# Altium project Q24_ECU_V1.PrjPcb (part 1 of 3)
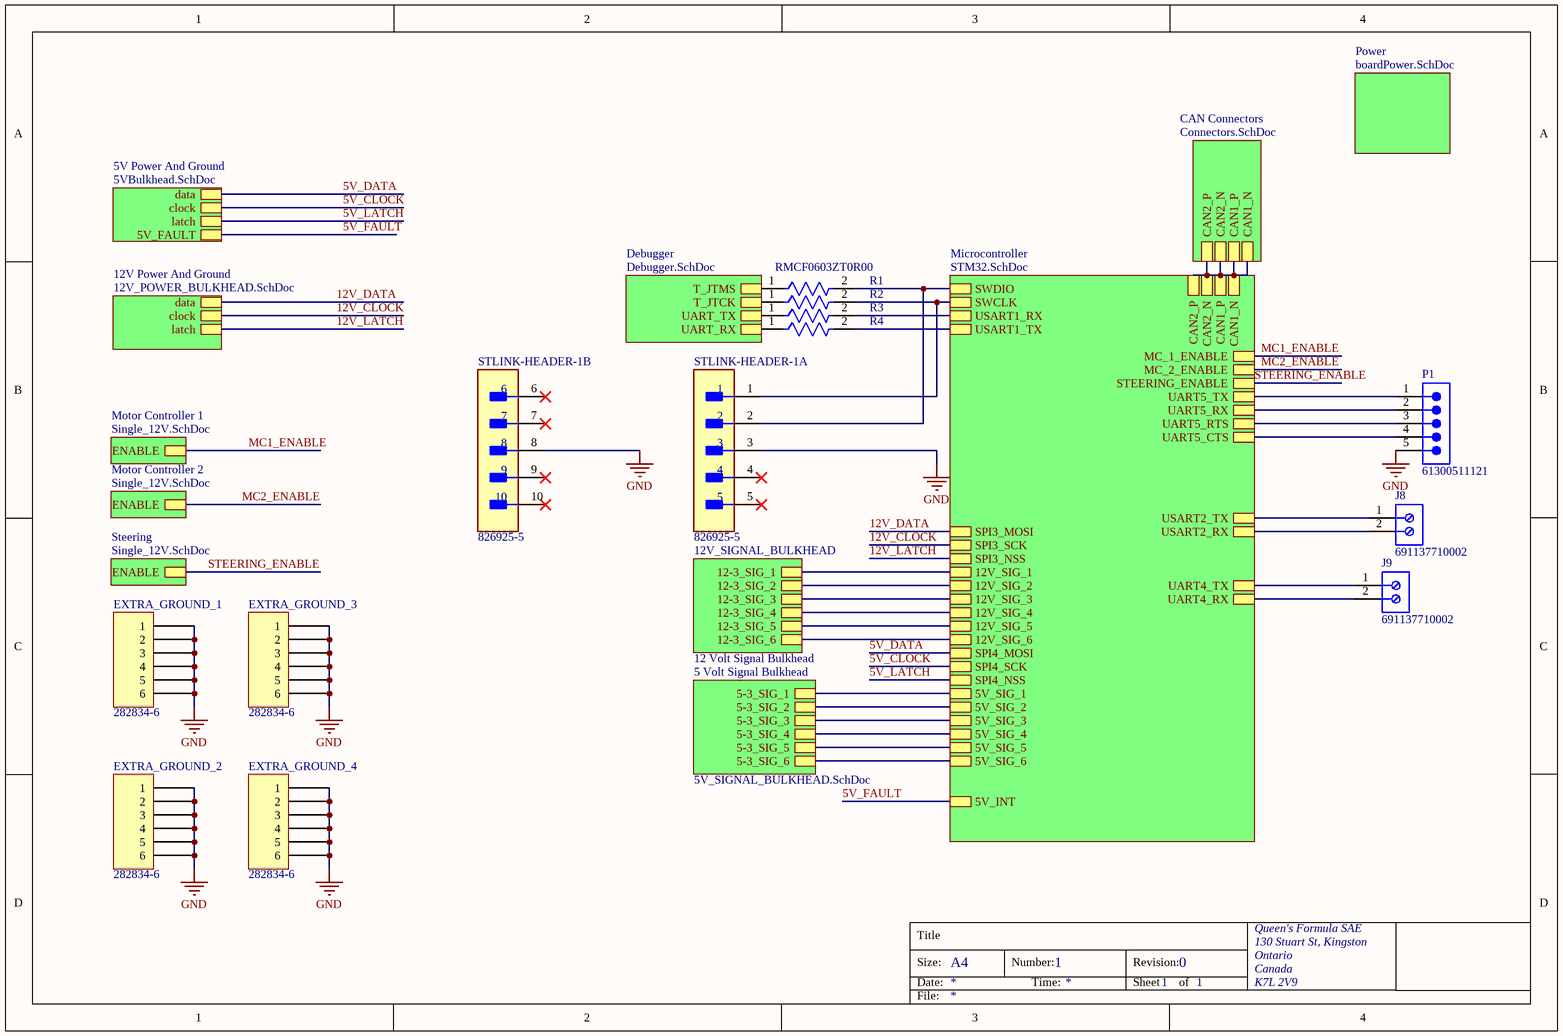
[diagram p0: TOP.SchDoc]
22 sheets, 325 parts. Net scope: hierarchical (ports join the sheet entries above them; power ports are global).
Board file: PCB.PcbDoc
Sheets:
  TOP.SchDoc
    Microcontroller = STM32.SchDoc
      CAN1 = CAN.SchDoc
      CAN2 = CAN.SchDoc
      Accelerometer And Gyro = IMU.SchDoc
    Debugger = Debugger.SchDoc
      MCU = DebuggerMCU.SchDoc
      POWER = Power.SchDoc
      CONNECTORS = DebuggerConnectors.SchDoc
    12V Power And Ground = 12V_POWER_BULKHEAD.SchDoc
      Shift Register = shiftRegister.SchDoc
      Designator = 12V_LS.SchDoc
      Designator = 12V_LS.SchDoc
      Designator = 12V_LS.SchDoc
      Designator = 12V_LS.SchDoc
      Designator = 12V_LS.SchDoc
      Designator = 12V_LS.SchDoc
    Power = boardPower.SchDoc
      Buck = Buck.SchDoc
      LDO = LDO.SchDoc
    CAN Connectors = Connectors.SchDoc
    12 Volt Signal Bulkhead = 12V_SIGNAL_BULKHEAD.SchDoc
       = 12_TO_3V3_VOLTAGE_DIVIDER.SchDoc
       = 12_TO_3V3_VOLTAGE_DIVIDER.SchDoc
       = 12_TO_3V3_VOLTAGE_DIVIDER.SchDoc
       = 12_TO_3V3_VOLTAGE_DIVIDER.SchDoc
       = 12_TO_3V3_VOLTAGE_DIVIDER.SchDoc
       = 12_TO_3V3_VOLTAGE_DIVIDER.SchDoc
    5V Power And Ground = 5VBulkhead.SchDoc
      Shift Register = shiftRegister.SchDoc
      5VLS1 = 5V_LS.SchDoc
      5VLS2 = 5V_LS.SchDoc
      5VLS3 = 5V_LS.SchDoc
      5VLS4 = 5V_LS.SchDoc
      5VLS5 = 5V_LS.SchDoc
      5VLS6 = 5V_LS.SchDoc
    5 Volt Signal Bulkhead = 5V_SIGNAL_BULKHEAD.SchDoc
      Designator = 5V_TO_3V_VD.SchDoc
      Designator = 5V_TO_3V_VD.SchDoc
      Designator = 5V_TO_3V_VD.SchDoc
      Designator = 5V_TO_3V_VD.SchDoc
      Designator = 5V_TO_3V_VD.SchDoc
      Designator = 5V_TO_3V_VD.SchDoc
    Motor Controller 1 = Single_12V.SchDoc
      Designator = 12V_LS.SchDoc
    Motor Controller 2 = Single_12V.SchDoc
      Designator = 12V_LS.SchDoc
    Steering = Single_12V.SchDoc
      Designator = 12V_LS.SchDoc

## Sheet TOP.SchDoc: =DocumentName
size A4; Organization: Queen's Formula SAE; Address1: 130 Stuart St, Kingston; Address2: Ontario; Address3: Canada; Address4: K7L 2V9; DocumentNumber: 1; Revision: 0; SheetNumber: 1; SheetTotal: 1

### Parts
EXTRA_GROUND_1  282834-6  [TE 282834-6]
EXTRA_GROUND_2  282834-6  [TE 282834-6]
EXTRA_GROUND_3  282834-6  [TE 282834-6]
EXTRA_GROUND_4  282834-6  [TE 282834-6]
J8  691137710002  [691137710002]
J9  691137710002  [691137710002]
P1  61300511121  [61300511121]
R1  RMCF0603ZT0R00  [FP-RMCF0603-MFG]
R2  RMCF0603ZT0R00  [FP-RMCF0603-MFG]  (value not drawn)
R3  RMCF0603ZT0R00  [FP-RMCF0603-MFG]  (value not drawn)
R4  RMCF0603ZT0R00  [FP-RMCF0603-MFG]  (value not drawn)
STLINK-HEADER-1  826925-5  [FP-826925-5-MFG]  (parts A,B of 2)

### Sub-sheets
5 Volt Signal Bulkhead = 5V_SIGNAL_BULKHEAD.SchDoc: 5-3_SIG_1, 5-3_SIG_2, 5-3_SIG_3, 5-3_SIG_4, 5-3_SIG_5, 5-3_SIG_6
5V Power And Ground = 5VBulkhead.SchDoc: data, clock, latch, 5V_FAULT
12 Volt Signal Bulkhead = 12V_SIGNAL_BULKHEAD: 12-3_SIG_1, 12-3_SIG_2, 12-3_SIG_3, 12-3_SIG_4, 12-3_SIG_5, 12-3_SIG_6
12V Power And Ground = 12V_POWER_BULKHEAD.SchDoc: data, clock, latch
CAN Connectors = Connectors.SchDoc: CAN1_N, CAN1_P, CAN2_N, CAN2_P
Debugger = Debugger.SchDoc: T_JTCK, T_JTMS, UART_TX, UART_RX
Microcontroller = STM32.SchDoc: SWDIO, SWCLK, USART1_RX, USART1_TX, SPI3_NSS, SPI3_MOSI, SPI3_SCK, CAN1_P, CAN1_N, CAN2_N, CAN2_P, 12V_SIG_1, MC_1_ENABLE, MC_2_ENABLE, STEERING_ENABLE, 12V_SIG_2, 12V_SIG_4, 12V_SIG_3, 12V_SIG_5, 12V_SIG_6, SPI4_NSS, SPI4_MOSI, SPI4_SCK, 5V_SIG_1, 5V_SIG_2, 5V_SIG_3, 5V_SIG_5, 5V_SIG_4, 5V_SIG_6, UART5_TX, UART5_RX, UART5_RTS, UART5_CTS, 5V_INT, USART2_TX, USART2_RX, UART4_TX, UART4_RX
Motor Controller 1 = Single_12V.SchDoc: ENABLE
Motor Controller 2 = Single_12V.SchDoc: ENABLE
Power = boardPower.SchDoc: no entries
Steering = Single_12V.SchDoc: ENABLE

### Nets
GND: EXTRA_GROUND_1.1 EXTRA_GROUND_1.2 EXTRA_GROUND_1.3 EXTRA_GROUND_1.4 EXTRA_GROUND_1.5 EXTRA_GROUND_1.6 EXTRA_GROUND_2.1 EXTRA_GROUND_2.2 EXTRA_GROUND_2.3 EXTRA_GROUND_2.4 EXTRA_GROUND_2.5 EXTRA_GROUND_2.6 EXTRA_GROUND_3.1 EXTRA_GROUND_3.2 EXTRA_GROUND_3.3 EXTRA_GROUND_3.4 EXTRA_GROUND_3.5 EXTRA_GROUND_3.6 EXTRA_GROUND_4.1 EXTRA_GROUND_4.2 EXTRA_GROUND_4.3 EXTRA_GROUND_4.4 EXTRA_GROUND_4.5 EXTRA_GROUND_4.6 P1.5 STLINK-HEADER-1.3 STLINK-HEADER-1.8
5-3_1: sheet Microcontroller/5V_SIG_1, sheet 5 Volt Signal Bulkhead/5-3_SIG_1
5-3_2: sheet Microcontroller/5V_SIG_2, sheet 5 Volt Signal Bulkhead/5-3_SIG_2
5-3_3: sheet Microcontroller/5V_SIG_3, sheet 5 Volt Signal Bulkhead/5-3_SIG_3
5-3_4: sheet Microcontroller/5V_SIG_4, sheet 5 Volt Signal Bulkhead/5-3_SIG_4
5-3_5: sheet Microcontroller/5V_SIG_5, sheet 5 Volt Signal Bulkhead/5-3_SIG_5
5-3_6: sheet Microcontroller/5V_SIG_6, sheet 5 Volt Signal Bulkhead/5-3_SIG_6
5V_CLOCK: sheet Microcontroller/SPI4_SCK, sheet 5V Power And Ground/clock
5V_DATA: sheet Microcontroller/SPI4_MOSI, sheet 5V Power And Ground/data
5V_FAULT: sheet Microcontroller/5V_INT, sheet 5V Power And Ground/5V_FAULT
5V_LATCH: sheet Microcontroller/SPI4_NSS, sheet 5V Power And Ground/latch
12-3_1: sheet Microcontroller/12V_SIG_1, sheet 12 Volt Signal Bulkhead/12-3_SIG_1
12-3_2: sheet Microcontroller/12V_SIG_2, sheet 12 Volt Signal Bulkhead/12-3_SIG_2
12-3_3: sheet Microcontroller/12V_SIG_3, sheet 12 Volt Signal Bulkhead/12-3_SIG_3
12-3_4: sheet Microcontroller/12V_SIG_4, sheet 12 Volt Signal Bulkhead/12-3_SIG_4
12-3_5: sheet Microcontroller/12V_SIG_5, sheet 12 Volt Signal Bulkhead/12-3_SIG_5
12-3_6: sheet Microcontroller/12V_SIG_6, sheet 12 Volt Signal Bulkhead/12-3_SIG_6
12V_CLOCK: sheet Microcontroller/SPI3_SCK, sheet 12V Power And Ground/clock
12V_DATA: sheet Microcontroller/SPI3_MOSI, sheet 12V Power And Ground/data
12V_LATCH: sheet Microcontroller/SPI3_NSS, sheet 12V Power And Ground/latch
CAN1_N: sheet Microcontroller/CAN1_P, sheet Microcontroller/CAN1_N, sheet Microcontroller/CAN2_N, sheet Microcontroller/CAN2_P, sheet CAN Connectors/CAN1_N, sheet CAN Connectors/CAN1_P, sheet CAN Connectors/CAN2_N, sheet CAN Connectors/CAN2_P
MC1_ENABLE: sheet Microcontroller/MC_1_ENABLE, sheet Motor Controller 1/ENABLE
MC2_ENABLE: sheet Microcontroller/MC_2_ENABLE, sheet Motor Controller 2/ENABLE
STEERING_ENABLE: sheet Microcontroller/STEERING_ENABLE, sheet Steering/ENABLE
T_JTCK: R2.1 ; sheet Debugger/T_JTCK
T_JTMS: R1.1 ; sheet Debugger/T_JTMS
UART_RX: R4.1 ; sheet Debugger/UART_RX
UART_TX: R3.1 ; sheet Debugger/UART_TX
NetJ8_1: J8.1 ; sheet Microcontroller/USART2_TX
NetJ8_2: J8.2 ; sheet Microcontroller/USART2_RX
NetJ9_1: J9.1 ; sheet Microcontroller/UART4_TX
NetJ9_2: J9.2 ; sheet Microcontroller/UART4_RX
NetP1_1: P1.1 ; sheet Microcontroller/UART5_TX
NetP1_2: P1.2 ; sheet Microcontroller/UART5_RX
NetP1_3: P1.3 ; sheet Microcontroller/UART5_RTS
NetP1_4: P1.4 ; sheet Microcontroller/UART5_CTS
NetR1_2: R1.2 STLINK-HEADER-1.2 ; sheet Microcontroller/SWDIO
NetR2_2: R2.2 STLINK-HEADER-1.1 ; sheet Microcontroller/SWCLK
NetR3_2: R3.2 ; sheet Microcontroller/USART1_RX
NetR4_2: R4.2 ; sheet Microcontroller/USART1_TX

Not connected (* = marked no-connect by the designer): STLINK-HEADER-1 4* 5* 6* 7* 9* 10*

### Notes on the sheet
- Title
- Size:
- Date:
- A4
- Number:
- Time:
- Revision:
- Sheet
- of
- File:

### Library data of the parts
EXTRA_GROUND_1-EXTRA_GROUND_4 = 282834-6: TERM BLK 6P SIDE ENT 2.54MM PCB; Manufacturer: TE Connectivity AMP Connectors; Current: 10A; Mating Orientation: Horizontal with Board; Number of Levels: 1; Pitch: 0.100" (2.54mm); Positions Per Level: 6; Voltage: 150V; Wire Gauge: 16-30 AWG; Wire Termination: Screw - Rising Cage Clamp; Part Number: 282834-6; Color: Green; ComponentLink1Description: Datasheet; ComponentLink1URL: https://www.te.com/commerce/DocumentDelivery/DDEController?Action=srchrtrv&DocNm=282834&DocType=Customer+Drawing&DocLang=English; ComponentLink2Description: DigiKey Link; ComponentLink2URL: http://digikey.com/product-detail/en/te-connectivity-amp-connectors/282834-6/A98337-ND/1153267; LastUpdated: 2020-01-15 4:16:31 AM; Lifecycle Status: Active; Minimum Order: 1; Mounting Type: Through Hole; Packaging: Bulk; Part Status: Active; Price: 4.72; Series: Buchanan; Supplier 1: DigiKey; Supplier Part Number 1: A98337-ND
J8 J9 = CMP-1502-03324-2: NexarPartId: 78871135; Voltage Rating: 300V; Number of Contacts: 2; Current Rating: 16A; Lead Pitch: 5mm; Height: 11.6mm; Packaging: Box; RoHS: Non-Compliant; Contact Material: Nickel, Tin; Max Operating Temperature: 120°C; Number of Pins: 2; Min Operating Temperature: -30°C; Number of Rows: 1
P1 = CMP-1502-01068-2: NexarPartId: 32855526; Operating Supply Voltage: 250V; Number of Contacts: 5; Connector Type: Male Pin; Current Rating: 3A; Contact Resistance: 20mΩ; Pitch: 2.54mm; Gender: Male; Termination: Solder; RoHS: Compliant; Lead Pitch: 2.54mm; Contact Mating Length: 5.9944mm; Number of Positions: 5; Lead Free: Lead Free; Contact Plating: Gold; Number of Pins: 5; Min Operating Temperature: -40°C; Voltage Rating: 250V; Color: Black; Mount: Through Hole; REACH SVHC: Unknown; Packaging: Bulk; Height: 8.89mm; Number of Rows: 1; Orientation: Vertical; Contact Material: Copper; Max Operating Temperature: 105°C
R1-R4 = CMP-26527-000011-1: RES 0 OHM JUMPER 1/10W 0603; Manufacturer: Stackpole; Power Rating: 0.1W; Voltage Rating: 75V; Resistance: 0mΩ; Automotive Grade: Grade 0; Value: 0mΩ; Series: RMCF; Manufacturer Part Number: RMCF0603ZT0R00; Device Class L1: Passive Components; Device Class L3: Chip SMD Resistors; Octopart: https://octopart.com/rmcf0603zt0r00-stackpole+electronics-19213618; Temperature: -55°C to +155°C; Lead Free: Yes; ComponentLink2URL: https://www.seielect.com/catalog/sei-rmcf_rmcp.pdf; Height: 0.55mm; Composition: Thick Film; Package: RMCF0603; Automotive: Yes; Temperature Range High: +155°C; Ipc Land Pattern Name: RESC15580X45; Digikey Description: RES 0 OHM JUMPER 1/10W 0603; RoHS: TRUE; ComponentLink2Description: Datasheet; Temperature Range Low: -55°C; Category: Res; Device Class L2: Resistors
STLINK-HEADER-1 = CMP-03369-000006-1: CONN HEADER VERT 10POS 2.54MM; Manufacturer: TE Connectivity; Conn Orientation: Vertical; Standoff Height: 0.3mm; Number Of Contacts: 10; Current Rating: 5A; Conn Gender: Male; Number Of Rows: 2; Category: Conn; Octopart: https://octopart.com/826925-5-te+connectivity-41836231; Lead Free: Yes; Height: 9.9mm; ComponentLink2Description: Datasheet; Temperature Range High: +105°C; Pitch: 2.54mm; Manufacturer Part Number: 826925-5; Automotive: No; Digikey Description: CONN HEADER VERT 10POS 2.54MM; ComponentLink2URL: https://www.te.com/commerce/DocumentDelivery/DDEController?Action=showdoc&DocId=Customer+Drawing%7F826629%7FAC%7Fpdf%7FEnglish%7FENG_CD_826629_AC.pdf%7F826925-5; Temperature: -65°C to +105°C; RoHS: TRUE; Package: 826925-5; Contact Material: Tin,Nickel; Mouser Description: Headers & Wire Housings 2X05 POS VERT TIN; Device Class L2: Headers and Wire Housings; Device Class L3: unset; Device Class L1: Connectors; Temperature Range Low: -65°C

## Sheet STM32.SchDoc
size A4
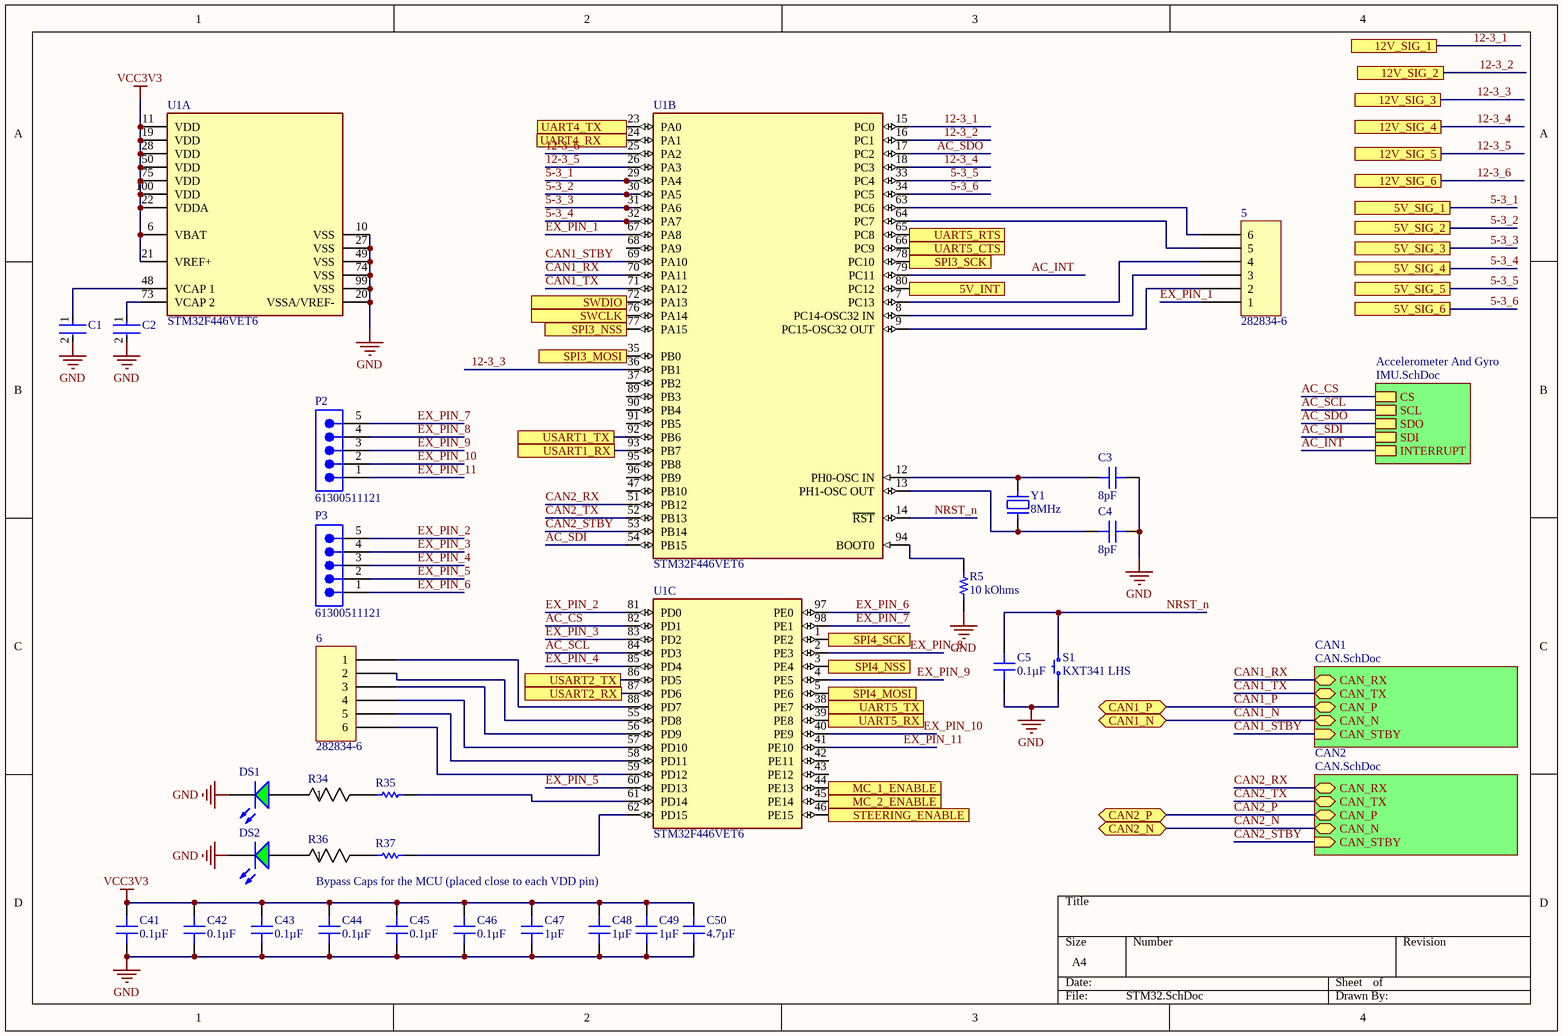
[diagram p1: STM32.SchDoc]

### Parts
5  282834-6  [TE 282834-6]
6  282834-6  [TE 282834-6]
C1  GRM188R71A225KE15D  [FP-GRM188-0_1-e0_2_0_5-MFG]  (value not drawn)
C2  GRM188R71A225KE15D  [FP-GRM188-0_1-e0_2_0_5-MFG]  (value not drawn)
C3  8pF  [CAP 0402_1005]
C4  8pF  [CAP 0402_1005]
C5  0.1µF  [CAP 0402_1005]
C41  0.1µF  [CAP 0402_1005]
C42  0.1µF  [CAP 0402_1005]
C43  0.1µF  [CAP 0402_1005]
C44  0.1µF  [CAP 0402_1005]
C45  0.1µF  [CAP 0402_1005]
C46  0.1µF  [CAP 0402_1005]
C47  1µF  [CAP 0402_1005]
C48  1µF  [CAP 0402_1005]
C49  1µF  [CAP 0402_1005]
C50  4.7µF  [CAP 0402_1005]
DS1  HLMP-4740  [AVAG-HLMP-4740]  (value not drawn)
DS2  HLMP-4740  [AVAG-HLMP-4740]  (value not drawn)
P2  61300511121  [61300511121]
P3  61300511121  [61300511121]
R5  10 kOhms  [RES 0402_1005]
R34  AC01000005000JA100  [RES_AC01_VIS]  (value not drawn)
R35  RC0805FR-071KL  [RESC2013X60X35ML10T20]  (value not drawn)
R36  AC01000005000JA100  [RES_AC01_VIS]  (value not drawn)
R37  RC0805FR-071KL  [RESC2013X60X35ML10T20]  (value not drawn)
S1  KXT341 LHS  [C&K KXT3]
U1  STM32F446VET6  [FP-LQFP100-1L-MFG]  (parts A,B,C of 3)
Y1  8MHz  [NDK NX3225GD]

### Sub-sheets
Accelerometer And Gyro = IMU.SchDoc: CS, SCL, SDO, SDI, INTERRUPT
CAN1 = CAN.SchDoc: CAN_RX (bidir), CAN_TX (bidir), CAN_STBY (in), CAN_P (bidir), CAN_N (bidir)
CAN2 = CAN.SchDoc: CAN_RX (bidir), CAN_TX (bidir), CAN_STBY (in), CAN_P (bidir), CAN_N (bidir)

### Ports
5V_INT, 5V_SIG_1, 5V_SIG_2, 5V_SIG_3, 5V_SIG_4, 5V_SIG_5, 5V_SIG_6, 12V_SIG_1, 12V_SIG_2, 12V_SIG_3, 12V_SIG_4, 12V_SIG_5, 12V_SIG_6, CAN1_N (bidir), CAN1_P (bidir), CAN2_N (bidir), CAN2_P (bidir), MC_1_ENABLE, MC_2_ENABLE, SPI3_MOSI, SPI3_NSS, SPI3_SCK, SPI4_MOSI, SPI4_NSS, SPI4_SCK, STEERING_ENABLE, SWCLK, SWDIO, UART4_RX, UART4_TX, UART5_CTS, UART5_RTS, UART5_RX, UART5_TX, USART1_RX, USART1_TX, USART2_RX, USART2_TX

### Nets
GND: C1.2 C2.2 C3.2 C4.2 C5.1 C41.1 C42.1 C43.1 C44.1 C45.1 C46.1 C47.1 C48.1 C49.1 C50.1 DS1.2(K) DS2.2(K) R5.1 S1.1 U1.10(VSS) U1.20(VSSA/VREF-) U1.27(VSS) U1.49(VSS) U1.74(VSS) U1.99(VSS)
VCC3V3: C41.2 C42.2 C43.2 C44.2 C45.2 C46.2 C47.2 C48.2 C49.2 C50.2 U1.6(VBAT) U1.11(VDD) U1.19(VDD) U1.21(VREF+) U1.22(VDDA) U1.28(VDD) U1.50(VDD) U1.75(VDD) U1.100(VDD)
5-3_1: U1.29(PA4) ; port 5V_SIG_1
5-3_2: U1.30(PA5) ; port 5V_SIG_2
5-3_3: U1.31(PA6) ; port 5V_SIG_3
5-3_4: U1.32(PA7) ; port 5V_SIG_4
5-3_5: U1.33(PC4) ; port 5V_SIG_5
5-3_6: U1.34(PC5) ; port 5V_SIG_6
5V_CLOCK: U1.1(PE2) ; port SPI4_SCK
5V_DATA: U1.5(PE6) ; port SPI4_MOSI
5V_FAULT: U1.80(PC12) ; port 5V_INT
5V_LATCH: U1.3(PE4) ; port SPI4_NSS
12-3_1: U1.15(PC0) ; port 12V_SIG_1
12-3_2: U1.16(PC1) ; port 12V_SIG_2
12-3_3: U1.36(PB1) ; port 12V_SIG_3
12-3_4: U1.18(PC3) ; port 12V_SIG_4
12-3_5: U1.26(PA3) ; port 12V_SIG_5
12-3_6: U1.25(PA2) ; port 12V_SIG_6
12V_CLOCK: U1.78(PC10) ; port SPI3_SCK
12V_DATA: U1.35(PB0) ; port SPI3_MOSI
12V_LATCH: U1.77(PA15) ; port SPI3_NSS
AC_CS: U1.82(PD1) ; sheet Accelerometer And Gyro/CS
AC_INT: U1.79(PC11) ; sheet Accelerometer And Gyro/INTERRUPT
AC_SCL: U1.84(PD3) ; sheet Accelerometer And Gyro/SCL
AC_SDI: U1.54(PB15) ; sheet Accelerometer And Gyro/SDI
AC_SDO: U1.17(PC2) ; sheet Accelerometer And Gyro/SDO
CAN1_N: port CAN1_P, port CAN1_N, port CAN2_P, port CAN2_N, sheet CAN1/CAN_P, sheet CAN1/CAN_N, sheet CAN2/CAN_P, sheet CAN2/CAN_N  [also labelled CAN1_P, CAN2_N, CAN2_P]
CAN1_RX: U1.70(PA11) ; sheet CAN1/CAN_RX
CAN1_STBY: U1.69(PA10) ; sheet CAN1/CAN_STBY
CAN1_TX: U1.71(PA12) ; sheet CAN1/CAN_TX
CAN2_RX: U1.51(PB12) ; sheet CAN2/CAN_RX
CAN2_STBY: U1.53(PB14) ; sheet CAN2/CAN_STBY
CAN2_TX: U1.52(PB13) ; sheet CAN2/CAN_TX
EX_PIN_1: 5.1 U1.67(PA8)
EX_PIN_2: P3.5 U1.81(PD0)
EX_PIN_3: P3.4 U1.83(PD2)
EX_PIN_4: P3.3 U1.85(PD4)
EX_PIN_5: P3.2 U1.60(PD13)
EX_PIN_6: P3.1 U1.97(PE0)
EX_PIN_7: P2.5 U1.98(PE1)
EX_PIN_8: P2.4 U1.2(PE3)
EX_PIN_9: P2.3 U1.4(PE5)
EX_PIN_10: P2.2 U1.40(PE9)
EX_PIN_11: P2.1 U1.41(PE10)
MC1_ENABLE: U1.44(PE13) ; port MC_1_ENABLE
MC2_ENABLE: U1.45(PE14) ; port MC_2_ENABLE
NRST_n: C5.2 S1.2 U1.14(~{RST})
STEERING_ENABLE: U1.46(PE15) ; port STEERING_ENABLE
Net5_2: 5.2 U1.9(PC15-OSC32_OUT)
Net5_3: 5.3 U1.8(PC14-OSC32_IN)
Net5_4: 5.4 U1.7(PC13)
Net5_5: 5.5 U1.64(PC7)
Net5_6: 5.6 U1.63(PC6)
Net6_1: 6.1 U1.88(PD7)
Net6_2: 6.2 U1.55(PD8)
Net6_3: 6.3 U1.56(PD9)
Net6_4: 6.4 U1.57(PD10)
Net6_5: 6.5 U1.58(PD11)
Net6_6: 6.6 U1.59(PD12)
NetC1_1: C1.1 U1.48(VCAP_1)
NetC2_1: C2.1 U1.73(VCAP_2)
NetC3_1: C3.1 U1.12(PH0-OSC_IN) Y1.2
NetC4_1: C4.1 U1.13(PH1-OSC_OUT) Y1.1
NetDS1_1: DS1.1(A) R34.1
NetDS2_1: DS2.1(A) R36.1
NetJ8_1: U1.86(PD5) ; port USART2_TX
NetJ8_2: U1.87(PD6) ; port USART2_RX
NetJ9_1: U1.23(PA0) ; port UART4_TX
NetJ9_2: U1.24(PA1) ; port UART4_RX
NetP1_1: U1.38(PE7) ; port UART5_TX
NetP1_2: U1.39(PE8) ; port UART5_RX
NetP1_3: U1.65(PC8) ; port UART5_RTS
NetP1_4: U1.66(PC9) ; port UART5_CTS
NetR1_2: U1.72(PA13) ; port SWDIO
NetR2_2: U1.76(PA14) ; port SWCLK
NetR3_2: U1.93(PB7) ; port USART1_RX
NetR4_2: U1.92(PB6) ; port USART1_TX
NetR5_2: R5.2 U1.94(BOOT0)
NetR34_2: R34.2 R35.1
NetR35_2: R35.2 U1.61(PD14)
NetR36_2: R36.2 R37.1
NetR37_2: R37.2 U1.62(PD15)

Not connected (* = marked no-connect by the designer): U1 37(PB2) 42(PE11) 43(PE12) 47(PB10) 68(PA9) 89(PB3) 90(PB4) 91(PB5) 95(PB8) 96(PB9)

### Notes on the sheet
- Bypass Caps for the MCU (placed close to each VDD pin)

### Library data of the parts
5 6 = 282834-6: as EXTRA_GROUND_1 on sheet TOP; Part Number: 282834-6; Color: Green; ComponentLink1Description: Datasheet; ComponentLink1URL: https://www.te.com/commerce/DocumentDelivery/DDEController?Action=srchrtrv&DocNm=282834&DocType=Customer+Drawing&DocLang=English; ComponentLink2Description: DigiKey Link; ComponentLink2URL: http://digikey.com/product-detail/en/te-connectivity-amp-connectors/282834-6/A98337-ND/1153267; LastUpdated: 2020-01-15 4:16:31 AM; Lifecycle Status: Active; Minimum Order: 1; Mounting Type: Through Hole; Packaging: Bulk; Part Status: Active; Price: 4.72; Series: Buchanan; Supplier 1: DigiKey; Supplier Part Number 1: A98337-ND
C1 C2 = CMP-2006-02836-2: Chip Multilayer Ceramic Capacitors for General Purpose, 0603, 2.2uF, X7R, 15%, 10%, 10V; Case Code (Metric): 1608; Height: 0.8mm; Packaging: Cut Tape; Voltage: 10V; Lead Free: Lead Free; Min Operating Temperature: -55°C; Voltage Rating (DC): 10V; Max Operating Temperature: 125°C; Voltage Rating: 10V; Dielectric: X7R; Depth: 0.8mm; Case Code (Imperial): 0603; Termination: SMD/SMT; Case/Package: 0603; Number of Pins: 2; REACH SVHC: No SVHC; Mount: Surface Mount; Width: 0.031inch; Material: Ceramic; Capacitance: 2.2uF; Package Quantity: 1; Weight: 7.1E-05oz; Length: 1.6mm; Thickness: 0.035inch; Tolerance: 10%
C3 C4 = C1005NP01H080D050BA: CAP CER 8PF 50V NP0 0402; Manufacturer: TDK Corporation; Temperature Coefficient: C0G, NP0; Tolerance: ±0.5pF; Part Number: C1005NP01H080D050BA; Value: 8pF; Applications: General Purpose; Capacitance: 8pF; ComponentLink1Description: Datasheet; ComponentLink1URL: https://product.tdk.com/info/en/catalog/datasheets/mlcc_commercial_hightemp_en.pdf?ref_disty=digikey; ComponentLink2Description: DigiKey Link; ComponentLink2URL: http://digikey.com/product-detail/en/tdk-corporation/C1005NP01H080D050BA/445-13781-1-ND/3955447; Device Package: 0402 (1005 Metric); Features: High Temperature; LastUpdated: 2020-09-02 1:02:24 AM; Lifecycle Status: Active; Minimum Order: 1; Mounting Type: Surface Mount, MLCC; Operating Temperature: -55°C ~ 150°C; Package / Case: 0402 (1005 Metric); Packaging: TapeAndReel; PartId: 2033; Part Status: Active; Price: 0.01; Series: C; Size / Dimension: 0.039" L x 0.020" W (1.00mm x 0.50mm); Supplier 1: DigiKey; Supplier Part Number 1: 445-13781-1-ND; Thickness (Max): 0.022" (0.55mm); Voltage - Rated: 50V
C5 C41-C46 = C0402C104K4RECAUTO: CAP CER 0402 0.1UF 16V X7R 10%; Manufacturer: KEMET; Part Number: C0402C104K4RECAUTO; Value: 0.1µF; Applications: Automotive, ESD Protection; Capacitance: 0.1µF; ComponentLink1Description: Datasheet; ComponentLink1URL: https://api.kemet.com/component-edge/download/datasheet/C0402C104K4RECAUTO.pdf; ComponentLink2Description: DigiKey Link; ComponentLink2URL: http://digikey.com/product-detail/en/kemet/C0402C104K4RECAUTO/399-17167-1-ND/8563708; Device Package: 0402 (1005 Metric); LastUpdated: 2020-09-02 1:02:25 AM; Lifecycle Status: Active; Minimum Order: 1; Mounting Type: Surface Mount, MLCC; Operating Temperature: -55°C ~ 125°C; Package / Case: 0402 (1005 Metric); Packaging: TapeAndReel; PartId: 1731; Part Status: Active; Price: 0.02; Series: ESD SMD Auto X7R; Size / Dimension: 0.039" L x 0.020" W (1.00mm x 0.50mm); Supplier 1: DigiKey; Supplier Part Number 1: 399-17167-1-ND; Temperature Coefficient: X7R; Thickness (Max): 0.022" (0.55mm); Tolerance: ±10%; Voltage - Rated: 16V; Ratings: AEC-Q200
C47-C49 = CGB2A1X5R1A105K033BC: CAP CER 1UF 10V X5R 0402; Manufacturer: TDK Corporation; Tolerance: ±10%; Part Number: CGB2A1X5R1A105K033BC; Value: 1µF; Applications: General Purpose; Capacitance: 1µF; ComponentLink1Description: Datasheet; ComponentLink1URL: https://product.tdk.com/info/en/catalog/datasheets/mlcc_commercial_lowprofile_en.pdf?ref_disty=digikey; ComponentLink2Description: DigiKey Link; ComponentLink2URL: http://digikey.com/product-detail/en/tdk-corporation/CGB2A1X5R1A105K033BC/445-13179-1-ND/3954845; Device Package: 0402 (1005 Metric); LastUpdated: 2020-09-02 1:02:25 AM; Lifecycle Status: Active; Minimum Order: 1; Mounting Type: Surface Mount, MLCC; Operating Temperature: -55°C ~ 85°C; Package / Case: 0402 (1005 Metric); Packaging: TapeAndReel; PartId: 1796; Part Status: Active; Price: 0.02; Series: CGB; Size / Dimension: 0.039" L x 0.020" W (1.00mm x 0.50mm); Supplier 1: DigiKey; Supplier Part Number 1: 445-13179-1-ND; Temperature Coefficient: X5R; Thickness (Max): 0.013" (0.33mm); Voltage - Rated: 10V; Features: Low Profile
C50 = C1005X5R1A475K050BC: CAP CER 4.7UF 10V X5R 0402; Manufacturer: TDK Corporation; Tolerance: ±10%; Part Number: C1005X5R1A475K050BC; Value: 4.7µF; Applications: General Purpose; Capacitance: 4.7µF; ComponentLink1Description: Datasheet; ComponentLink1URL: https://product.tdk.com/info/en/catalog/datasheets/mlcc_commercial_general_en.pdf?ref_disty=digikey; ComponentLink2Description: DigiKey Link; ComponentLink2URL: http://digikey.com/product-detail/en/tdk-corporation/C1005X5R1A475K050BC/445-13820-1-ND/3955486; Device Package: 0402 (1005 Metric); LastUpdated: 2020-09-02 1:02:25 AM; Lifecycle Status: Active; Minimum Order: 1; Mounting Type: Surface Mount, MLCC; Operating Temperature: -55°C ~ 85°C; Package / Case: 0402 (1005 Metric); Packaging: TapeAndReel; PartId: 1759; Part Status: Active; Price: 0.10; Series: C; Size / Dimension: 0.039" L x 0.020" W (1.00mm x 0.50mm); Supplier 1: DigiKey; Supplier Part Number 1: 445-13820-1-ND; Temperature Coefficient: X5R; Thickness (Max): 0.022" (0.55mm); Voltage - Rated: 10V; Features: Low ESL
DS1 DS2 = CMP-2000-06413-1: T-1 3/4 (5 mm) Low Current LED Lamp, Green, 1.9 V, -20 to 100 degC, 2-Pin THD, RoHS, Bulk; Manufacturer: AvagoTechnologies; Type: Uni-Color; Peak Wavelength: 565nm; Rad Hard: No; Viewing Angle: 50°; Dominant Wavelength/Color Temperature: 569nm; Number of LEDs: 1; Lens Appearance: ColoredDiffused; Lens Shape Type: Circular; Mounting Orientation: TopMount; Intensity: 2.3mcd; Datasheet Version: 07/2014; Category: LEDs; Datasheet URL: http://docs.avagotech.com/docs/AV02-1557EN; Packaging: Bulk; Pin Count: 2; Mounting Technology: ThroughHole; Package Reference: HLMP-4740; Mounting: ThroughHole; Manufacturer URL: http://www.avagotech.com/; Color: Green; Package: 2T-13/4; Package Description: 2-Pin Through Hole Device, Dia 5.845 mm, Pitch 2.54 mm
P2 P3 = CMP-1502-01068-2: as P1 on sheet TOP; Termination: Solder; RoHS: Compliant; Lead Pitch: 2.54mm; Contact Mating Length: 5.9944mm; Number of Positions: 5; Lead Free: Lead Free; Contact Plating: Gold; Number of Pins: 5; Min Operating Temperature: -40°C; Voltage Rating: 250V; Color: Black; Mount: Through Hole; REACH SVHC: Unknown; Packaging: Bulk; Height: 8.89mm; Number of Rows: 1; Orientation: Vertical; Contact Material: Copper; Max Operating Temperature: 105°C
R5 = CRCW040210K0DHEDP: RES SMD 10K OHM 0.5% 1/16W 0402; Manufacturer: Vishay Dale; Power (Watts): 0.063W, 1/16W; Temperature Coefficient: ±50ppm/°C; Part Number: CRCW040210K0DHEDP; Value: 10 kOhms; ComponentLink1Description: Datasheet; ComponentLink1URL: http://www.vishay.com/docs/20036/dcrcwpe3.pdf; ComponentLink2Description: DigiKey Link; ComponentLink2URL: http://digikey.com/product-detail/en/vishay-dale/CRCW040210K0DHEDP/541-10KAVCT-ND/3593906; Composition: Thick Film; Device Package: 0402 (1005 Metric); Height - Seated (Max): 0.016" (0.40mm); LastUpdated: 2020-09-02 1:08:05 AM; Lifecycle Status: Active; Minimum Order: 1; Number of Terminations: 2; Operating Temperature: -55°C ~ 155°C; Package / Case: 0402 (1005 Metric); Packaging: TapeAndReel; PartId: 5057; Part Status: Active; Price: 0.03; Resistance: 10 kOhms; Series: CRCW-P; Size / Dimension: 0.039" L x 0.020" W (1.00mm x 0.50mm); Supplier 1: DigiKey; Supplier Part Number 1: 541-10KAVCT-ND; Supplier Device Package: 0402; Tolerance: ±0.5%; Features: Automotive AEC-Q200; Ratings: AEC-Q200
R34 R36 = CMP-00030-39746512-1: AC01000005000JA100 Res Wirewound 500 Ohm 5% 1W 100ppm/°C to 180ppm/°C Conformal AXL Thru-Hole Ammo Pack; Voltage Rating (DC): 22V; Lead Diameter: 800µm; Resistance: 500Ω; Weight: 519.986953mg; Number of Pins: 2; Min Operating Temperature: -40°C; Case/Package: Axial; Schedule B: 8533210080, 8533210080; Features: Flame Retardant Coating; Power Rating: 1W; Max Power Dissipation: 1W; Packaging: Tape & Box (TB); RoHS: Compliant; REACH SVHC: Unknown; NexarPartId: 39746512; Temperature Coefficient: 180ppm/°C; Diameter: 4.3mm; Contact Plating: Tin; Radiation Hardening: No; Max Operating Temperature: 275°C; Length: 11mm; Tolerance: 5%; Composition: Wirewound; Number of Terminations: 2; Termination: Axial; Voltage Rating: 22V
R35 R37 = CMP-2100-03671-1: Chip Resistor, 1 KOhm, +/- 1%, 125 mW, -55 to 155 degC, 0805 (2012 Metric), RoHS, Tape and Reel; Manufacturer: Yageo; Temperature Coefficient: 100ppm/degreesC; Voltage Rating (DC): 150V; Max Power Dissipation: 125mW; Resistance: 1KOhm; Number of Pins: 2; Number of Terminations: 2; Datasheet URL: http://www.yageo.com/NewPortal/yageodocoutput?fileName=/pdf/R-Chip/PYu-RC_Group_51_RoHS_L_5.pdf; Length: 0.079inch; Package Description: 2-Pin Surface Mounted Device, Body 2 x 1.25 mm; Depth: 1.25mm; Height: 0.024inch; Military Standard: Not; Case/Package: 0805; Package Reference: 0805; RoHSCompliant: true; Lead Free: LeadFree; Packaging: TapeandReel; Package Quantity: 1; Datasheet Version: Rev. 5, 10/2016; Tolerance: 1%; Min Operating Temperature: -55degC; Voltage Rating: 150V; Composition: ThickFilm; Case Code (Imperial): 0805; Power Rating: 125mW; Width: 0.049inch; Case Code (Metric): 2012; Manufacturer URL: http://www.yageo.com/; Max Operating Temperature: 155degC; REACH SVHC: Unknown; Termination: SMD/SMT
S1 = KXT341 LHS: SWITCH TACTILE SPST-NO 0.02A 15V; Manufacturer: C&K; Actuator Height off PCB, Vertical: 0.60mm; Actuator Orientation: Top Actuated; Actuator Type: Standard; Contact Rating @ Voltage: 0.02A @ 15VDC; Illumination: Non-Illuminated; Operating Force: 330gf; Outline: 3.00mm x 2.00mm; Switch Function: Off-Mom; Part Number: KXT341 LHS; Circuit: SPST-NO; ComponentLink1Description: Datasheet; ComponentLink1URL: https://dznh3ojzb2azq.cloudfront.net/products/Tactile/KXT3/documents/datasheet.pdf; ComponentLink2Description: DigiKey Link; ComponentLink2URL: http://digikey.com/product-detail/en/c-k/KXT341-LHS/CKN10781CT-ND/6607324; LastUpdated: 2020-09-02 1:27:07 AM; Lifecycle Status: Active; Minimum Order: 1; Mounting Type: Surface Mount; Operating Temperature: -40°C ~ 85°C; Packaging: TapeAndReel; Part Status: Active; Price: 0.14; Series: KXT3; Supplier 1: DigiKey; Supplier Part Number 1: CKN10781CT-ND; Termination Style: SMD (SMT) Tab
U1 = CMP-12105-000075-1: IC MCU 32BIT 512KB FLASH 100LQFP; Manufacturer: STMicroelectronics; Ram Size: 128KBytes; Data Bus Width: 32bits; Max Junction Temp: +125°C; Number Of Adc Channels: 16; Max Supply Voltage: 3.6V; Nominal Supply Current: 1.4-86mA; Number Of Uart Channels: 6; Core Architecture: ARM Cortex-M4; Standoff Height: 0.05mm; Number Of A/D Converters: 3; Frequency: 180MHz; Number Of Cores: 1; Min Supply Voltage: 1.65V; Number Of Timers/Counters: 14; Number Of Usb Channels: 2; Number Of Spi Channels: 4; Interface: I2C,SPI,UART,USART,Parallel,CAN,USB,LIN,IrDA,I2S,Other; Memory Size: 512KBytes; Number Of I/Os: 81; Ambient Temperature Range High: +85°C; Mouser Description: ARM Microcontrollers - MCU High-performance and DSP with FPU, ARM Cortex-M4 MCU with 512 Kbytes Flash, 180 MHz CPU, Art Accelerator, SDRAM; Device Class L2: Embedded Processors and Controllers; Temperature Range Low: -40°C; Device Class L1: Integrated Circuits (ICs); RoHS: TRUE; Ipc Land Pattern Name: QFP50P1600X1600X160-100; Manufacturer Part Number: STM32F446VET6; Octopart: https://octopart.com/stm32f446vet6-stmicroelectronics-52642922; Package: LQFP100-1L; Automotive: No; Category: IC; ComponentLink2URL: https://www.st.com/resource/en/datasheet/stm32f446ve.pdf; Digikey Description: IC MCU 32BIT 512KB FLASH 100LQFP; Temperature Range High: +85°C; Memory Type: FLASH; Lead Free: Yes; Height: 1.6mm; ComponentLink2Description: Datasheet; Number Of I2C Channels: 4; Device Class L3: Microcontrollers; Temperature: -40°C to +85°C; Ambient Temperature Range Low: -40°C
Y1 = NX3225GD-8MHZ-STD-CRA-3: CRYSTAL 8.0000MHZ 8PF SMD; Manufacturer: NDK America, Inc.; ESR (Equivalent Series Resistance): 500 Ohms; Frequency Stability: ±150ppm; Frequency Tolerance: ±50ppm; Operating Mode: Fundamental; Part Number: NX3225GD-8MHZ-STD-CRA-3; ComponentLink1Description: Datasheet; ComponentLink1URL: http://www.ndk.com/images/products/catalog/c_NX3225GD-STD-CRA-3_e.pdf; ComponentLink2Description: DigiKey Link; ComponentLink2URL: http://digikey.com/product-detail/en/ndk-america-inc/NX3225GD-8MHZ-STD-CRA-3/644-1178-1-ND/3125567; Frequency: 8MHz; Height - Seated (Max): 0.039" (1.00mm); LastUpdated: 2020-09-02 1:25:56 AM; Lifecycle Status: Active; Load Capacitance: 8pF; Minimum Order: 1; Mounting Type: Surface Mount; Operating Temperature: -40°C ~ 150°C; Package / Case: 2-SMD, No Lead; Packaging: TapeAndReel; PartId: 744; Part Status: Active; Price: 0.48; Ratings: AEC-Q200; Series: NX3225GD; Size / Dimension: 0.126" L x 0.098" W (3.20mm x 2.50mm); Supplier 1: DigiKey; Supplier Part Number 1: 644-1178-1-ND; Type: MHz Crystal; Value: 8MHz

## Sheet CAN.SchDoc
size A4
Used 2 times, as channels Microcontroller/CAN1, Microcontroller/CAN2. Parts and nets are listed once, with the designators drawn on the sheet.
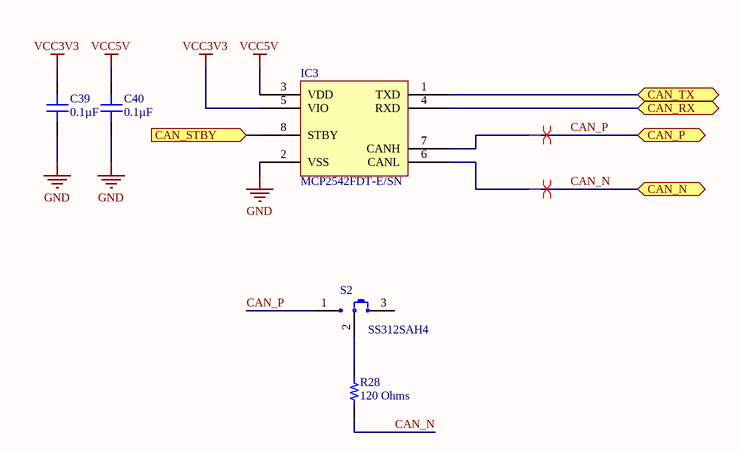
[diagram p2: CAN.SchDoc]

### Parts
C39  0.1µF  [CAP 0201_0603]
C40  0.1µF  [CAP 0201_0603]
IC3  MCP2542FDT-E/SN  [MICROCHIP SOIC-8 150MIL WIDE]
R28  120 Ohms  [RES 0402_1005]
S2  SS312SAH4  [NKK SS312SAH4]

### Ports
CAN_N (bidir), CAN_P (bidir), CAN_RX (bidir), CAN_STBY (in), CAN_TX (bidir)

### Nets
GND: C39.1 C40.1 IC3.2(VSS)
VCC3V3: C39.2 IC3.5(VIO)
VCC5V: C40.2 IC3.3(VDD)
CAN_N: IC3.6(CANL) R28.1 ; port CAN_N
CAN_P: IC3.7(CANH) S2.1 ; port CAN_P
CAN_RX: IC3.4(RXD) ; port CAN_RX
CAN_STBY: IC3.8(STBY) ; port CAN_STBY
CAN_TX: IC3.1(TXD) ; port CAN_TX
NetR28_2: R28.2 S2.2(COM)

Not connected (* = marked no-connect by the designer): S2 3

### Channels
Microcontroller/CAN1: designators end in _CAN1; ports CAN_N=CAN1_N CAN_P=CAN1_N CAN_RX=CAN1_RX CAN_STBY=CAN1_STBY CAN_TX=CAN1_TX
Microcontroller/CAN2: designators end in _CAN2; ports CAN_N=CAN1_N CAN_P=CAN1_N CAN_RX=CAN2_RX CAN_STBY=CAN2_STBY CAN_TX=CAN2_TX

### Layout directives
differential pair: CAN1_N

### Library data of the parts
C39 C40 = EMK063BJ104KP-F: CAP CER 0.1UF 16V X5R 0201; Manufacturer: Taiyo Yuden; Tolerance: ±10%; Part Number: EMK063BJ104KP-F; Value: 0.1µF; Applications: General Purpose; Capacitance: 0.1µF; ComponentLink1Description: Datasheet; ComponentLink1URL: https://ds.yuden.co.jp/TYCOMPAS/ut/detail?pn=EMK063BJ104KP-F  &u=M; ComponentLink2Description: DigiKey Link; ComponentLink2URL: http://digikey.com/product-detail/en/taiyo-yuden/EMK063BJ104KP-F/587-5833-1-ND/7674954; Device Package: 0201 (0603 Metric); LastUpdated: 2020-09-02 1:00:18 AM; Lifecycle Status: Active; Minimum Order: 1; Mounting Type: Surface Mount, MLCC; Operating Temperature: -55°C ~ 85°C; Package / Case: 0201 (0603 Metric); Packaging: TapeAndReel; PartId: 12; Part Status: Active; Price: 0.02; Series: M; Size / Dimension: 0.024" L x 0.012" W (0.60mm x 0.30mm); Supplier 1: DigiKey; Supplier Part Number 1: 587-5833-1-ND; Temperature Coefficient: X5R; Thickness (Max): 0.013" (0.33mm); Voltage - Rated: 16V
IC3 = MCP2542FDT-E/SN: IC TRANSCEIVER 1/1 8SOIC; Manufacturer: Microchip Technology; Data Rate: 8Mbps; Protocol: CANbus; Receiver Hysteresis: 200mV; Voltage - Supply: 4.5V ~ 5.5V; Part Number: MCP2542FDT-E/SN; ComponentLink1Description: Datasheet; ComponentLink1URL: http://www.microchip.com/mymicrochip/filehandler.aspx?ddocname=en585412; ComponentLink2Description: DigiKey Link; ComponentLink2URL: http://digikey.com/product-detail/en/microchip-technology/MCP2542FDT-E-SN/MCP2542FDT-E-SNCT-ND/9642863; Device Package: 8-SOIC (0.154", 3.90mm Width); LastUpdated: 2020-05-24 11:07:13 PM; Lifecycle Status: Active; Minimum Order: 1; Mounting Type: Surface Mount; Number of Drivers/Receivers: 1/1; Operating Temperature: -40°C ~ 125°C; Package / Case: 8-SOIC (0.154", 3.90mm Width); Packaging: TapeAndReel; Part Status: Active; Price: 0.59; Series: -; Supplier 1: DigiKey; Supplier Part Number 1: MCP2542FDT-E/SNCT-ND; Supplier Device Package: 8-SOIC; Type: Transceiver
R28 = RC0402JR-07120RL: RES SMD 120 OHM 5% 1/16W 0402; Manufacturer: Yageo; Power (Watts): 0.063W, 1/16W; Temperature Coefficient: ±100ppm/°C; Part Number: RC0402JR-07120RL; Value: 120 Ohms; ComponentLink1Description: Datasheet; ComponentLink1URL: https://www.yageo.com/upload/media/product/productsearch/datasheet/rchip/PYu-RC_Group_51_RoHS_L_10.pdf; ComponentLink2Description: DigiKey Link; ComponentLink2URL: http://digikey.com/product-detail/en/yageo/RC0402JR-07120RL/311-120JRCT-ND/2827967; Composition: Thick Film; Device Package: 0402 (1005 Metric); Features: Moisture Resistant; Height - Seated (Max): 0.016" (0.40mm); LastUpdated: 2020-09-02 1:08:05 AM; Lifecycle Status: Active; Minimum Order: 1; Number of Terminations: 2; Operating Temperature: -55°C ~ 155°C; Package / Case: 0402 (1005 Metric); Packaging: CutTape; PartId: 4797; Part Status: Active; Price: 0.10; Resistance: 120 Ohms; Series: RC; Size / Dimension: 0.039" L x 0.020" W (1.00mm x 0.50mm); Supplier 1: DigiKey; Supplier Part Number 1: 311-120JRCT-ND; Supplier Device Package: 0402; Tolerance: ±5%
S2 = SS312SAH4: SWITCH SLIDE SPDT 0.4VA 28V; Manufacturer: NKK Switches; Actuator Length: 2.00mm; Actuator Type: Standard; Contact Timing: Shorting (MBB); Current Rating (Amps): 0.4VA (AC/DC); Switch Function: On-On; Part Number: SS312SAH4; Circuit: SPDT; ComponentLink1Description: Datasheet; ComponentLink1URL: http://www.nkkswitches.com/pdf/SS3surfaceMount-1.pdf; ComponentLink2Description: DigiKey Link; ComponentLink2URL: http://digikey.com/product-detail/en/nkk-switches/SS312SAH4/360-3250-ND/1052031; Contact Finish: Gold; Contact Material: Phosphor Bronze; LastUpdated: 2020-01-04 7:15:23 PM; Lifecycle Status: Active; Minimum Order: 1; Mounting Type: Surface Mount, Right Angle; Operating Temperature: -25°C ~ 85°C; Packaging: Tray; PartId: 2; Part Status: Active; Price: 3.02; Series: SS3; Supplier 1: DigiKey; Supplier Part Number 1: 360-3250-ND; Termination Style: Gull Wing; Voltage Rating - AC: 28V; Voltage Rating - DC: 28V

## Sheet IMU.SchDoc
size A4
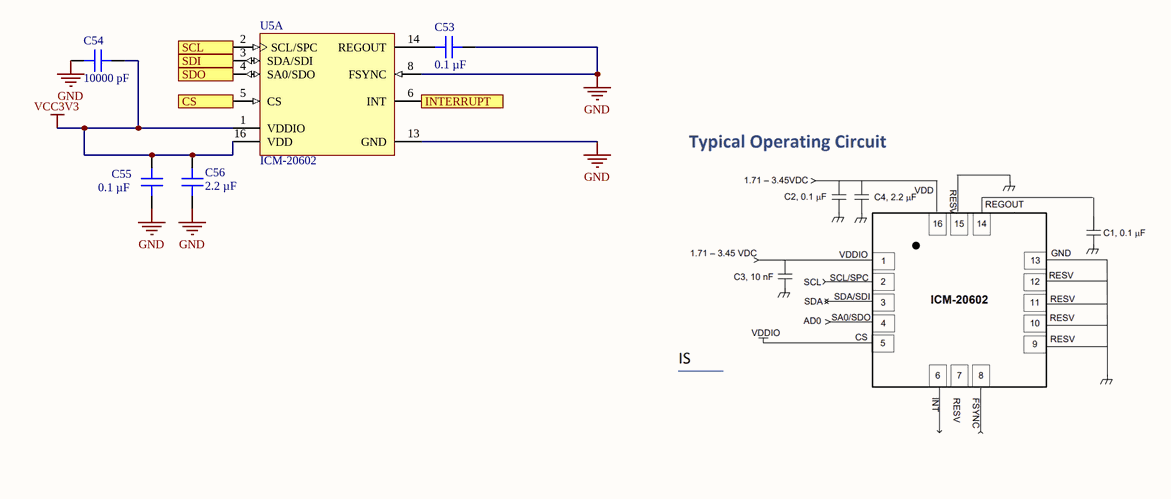
[diagram p3: IMU.SchDoc]

### Parts
C53  0.1 µF  [CAP 0603_1608]
C54  10000 pF  [CAP 0603_1608]
C55  0.1 µF  [CAP 0603_1608]
C56  2.2 µF  [CAP 0603_1608]
U5  ICM-20602  [INSE-I62-16]  (part A of 2)

### Ports
CS, INTERRUPT, SCL, SDI, SDO

### Nets
GND: C53.2 C54.1 C55.1 C56.1 U5.8(FSYNC) U5.13(GND)
VCC3V3: C54.2 C55.2 C56.2 U5.1(VDDIO) U5.16(VDD)
AC_CS: U5.5(CS) ; port CS
AC_INT: U5.6(INT) ; port INTERRUPT
AC_SCL: U5.2(SCL/SPC) ; port SCL
AC_SDI: U5.3(SDA/SDI) ; port SDI
AC_SDO: U5.4(SA0/SDO) ; port SDO
NetC53_1: C53.1 U5.14(REGOUT)

### Library data of the parts
C53 C55 = C0603C104K5RAC7411: CAP CER 0.1UF 50V X7R 0603; manufacturer: KEMET; Tolerance: ±10%; Part Number: C0603C104K5RAC7411; Value: 0.1 µF; Applications: Bypass, Decoupling; Capacitance: 0.1 µF; componentlink1description: Datasheet; componentlink1url: https://api.kemet.com/component-edge/download/datasheet/C0603C104K5RAC7411.pdf; componentlink2description: DigiKey Link; componentlink2url: https://www.digikey.com/en/products/detail/kemet/C0603C104K5RAC7411/3317013; Device Package: 0603 (1608 Metric); lastupdated: 2023-06-07 7:13:18 PM; Lifecycle Status: Active; Minimum Order: 1; Mounting Type: Surface Mount, MLCC; Operating Temperature: -55°C ~ 125°C; Package / Case: 0603 (1608 Metric); packaging: TapeAndReel; partid: 2233; Part Status: Active; price: 0.01; series: SMD Comm X7R; Size / Dimension: 0.063" L x 0.031" W (1.60mm x 0.80mm); Supplier 1: DigiKey; Supplier Part Number 1: 399-C0603C104K5RAC7411CT-ND; Temperature Coefficient: X7R; Thickness (Max): 0.035" (0.90mm); Voltage - Rated: 50V
C54 = C0603C103K4RECAUTO: CAP CER 0603 10NF 16V X7R 10%; manufacturer: KEMET; Part Number: C0603C103K4RECAUTO; Value: 10000 pF; Applications: Automotive, ESD Protection; Capacitance: 10000 pF; componentlink1description: Datasheet; componentlink1url: https://api.kemet.com/component-edge/download/datasheet/C0603C103K4RECAUTO.pdf; componentlink2description: DigiKey Link; componentlink2url: https://www.digikey.com/en/products/detail/kemet/C0603C103K4RECAUTO/8640474; Device Package: 0603 (1608 Metric); lastupdated: 2023-06-07 7:13:03 PM; Lifecycle Status: Active; Minimum Order: 1; Mounting Type: Surface Mount, MLCC; Operating Temperature: -55°C ~ 125°C; Package / Case: 0603 (1608 Metric); packaging: TapeAndReel; partid: 8251; Part Status: Active; price: 0.01; Ratings: AEC-Q200; series: ESD SMD Auto X7R; Size / Dimension: 0.063" L x 0.031" W (1.60mm x 0.80mm); Supplier 1: DigiKey; Supplier Part Number 1: 399-17880-1-ND; Temperature Coefficient: X7R; Thickness (Max): 0.034" (0.87mm); Tolerance: ±10%; Voltage - Rated: 16V
C56 = CC0603ZRY5V6BB225: CAP CER 2.2UF 10V Y5V 0603; manufacturer: Yageo; Temperature Coefficient: Y5V (F); Tolerance: -20%, +80%; Part Number: CC0603ZRY5V6BB225; Value: 2.2 µF; Applications: General Purpose; Capacitance: 2.2 µF; componentlink1description: Datasheet; componentlink1url: http://www.yageo.com/documents/recent/UPY-GPHC_Y5V_6.3V-to-50V_8.pdf; componentlink2description: DigiKey Link; componentlink2url: https://www.digikey.com/en/products/detail/yageo/CC0603ZRY5V6BB225/2833615; Device Package: 0603 (1608 Metric); lastupdated: 2023-06-07 7:13:18 PM; Lifecycle Status: Active; Minimum Order: 1; Mounting Type: Surface Mount, MLCC; Operating Temperature: -30°C ~ 85°C; Package / Case: 0603 (1608 Metric); packaging: TapeAndReel; partid: 2248; Part Status: Active; price: 0.01; series: CC; Size / Dimension: 0.063" L x 0.031" W (1.60mm x 0.80mm); Supplier 1: DigiKey; Supplier Part Number 1: 311-1450-1-ND; Thickness (Max): 0.035" (0.90mm); Voltage - Rated: 10V
U5 = CMP-2000-07589-1: High Performance 6-Axis MEMS MotionTracking(TM) Device, 1.71 to 3.45 V, -40 to 85 degC, 16-Pin LGA, RoHS; Manufacturer: InvenSense; Sensor Type: Temperature; Output Type: I2C; RoHSCompliant: True; Datasheet Version: Rev. 1.0, 10/2016; Datasheet URL: http://www.invensense.com/wp-content/uploads/2016/10/DS-000176-ICM-20602-v1.0.pdf; Min Operating Temperature: -40degC; Mounting Technology: SurfaceMount; Max Operating Temperature: 85degC; Manufacturer URL: http://www.invensense.com/; Package Reference: I62-16; Package Description: 16-Pin Land Grid Array, Body 3 x 3 mm, Pitch 0.5 mm

## Sheet Debugger.SchDoc
size A4
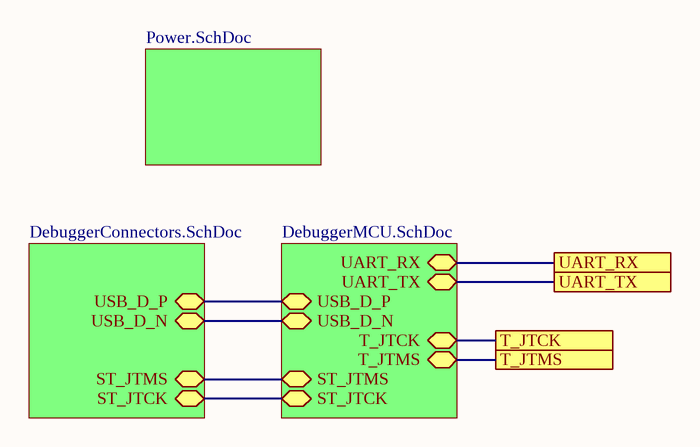
[diagram p4: Debugger.SchDoc]

### Sub-sheets
CONNECTORS = DebuggerConnectors.SchDoc: USB_D_P (bidir), USB_D_N (bidir), ST_JTMS (bidir), ST_JTCK (bidir)
MCU = DebuggerMCU.SchDoc: UART_RX (bidir), UART_TX (bidir), USB_D_P (bidir), USB_D_N (bidir), T_JTCK (bidir), T_JTMS (bidir), ST_JTMS (bidir), ST_JTCK (bidir)
POWER = Power.SchDoc: no entries

### Ports
T_JTCK, T_JTMS, UART_RX, UART_TX

### Nets
ST_JTCK: sheet MCU/ST_JTCK, sheet CONNECTORS/ST_JTCK
ST_JTMS: sheet MCU/ST_JTMS, sheet CONNECTORS/ST_JTMS
T_JTCK: port T_JTCK, sheet MCU/T_JTCK
T_JTMS: port T_JTMS, sheet MCU/T_JTMS
UART_RX: port UART_RX, sheet MCU/UART_RX
UART_TX: port UART_TX, sheet MCU/UART_TX
USB_D_N: sheet MCU/USB_D_N, sheet CONNECTORS/USB_D_N
USB_D_P: sheet MCU/USB_D_P, sheet CONNECTORS/USB_D_P

## Sheet DebuggerMCU.SchDoc
size A4
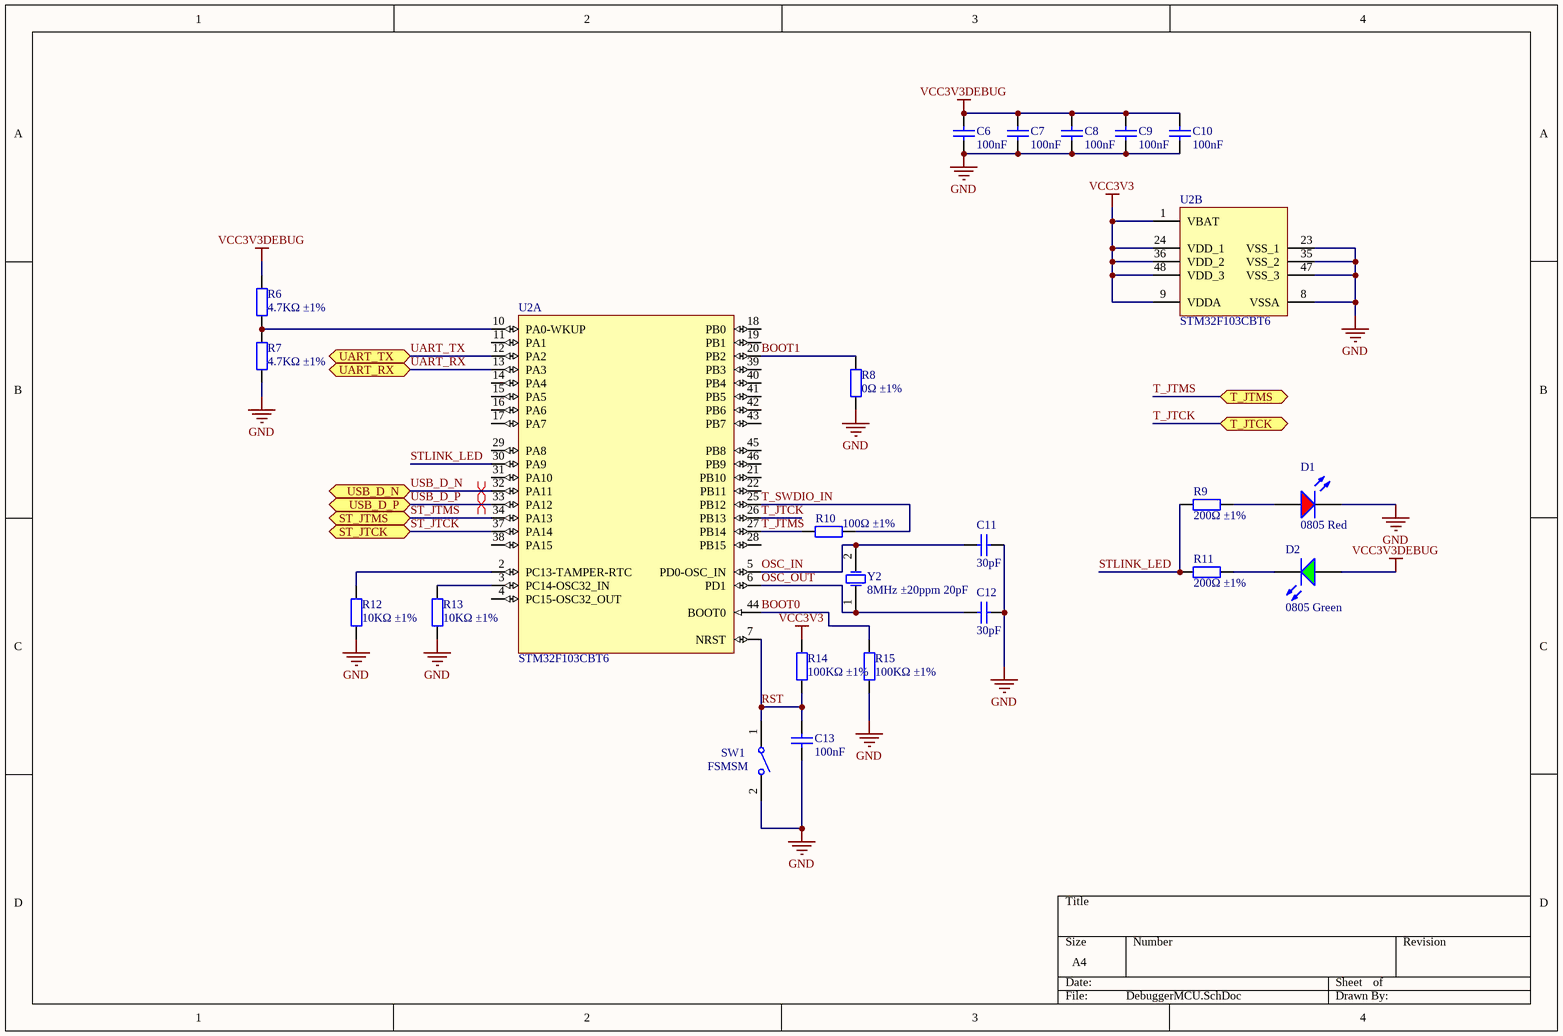
[diagram p5: DebuggerMCU.SchDoc]

### Parts
C6  100nF  [0402_C]
C7  100nF  [0402_C]
C8  100nF  [0402_C]
C9  100nF  [0402_C]
C10  100nF  [0402_C]
C11  30pF  [0402_C]
C12  30pF  [0402_C]
C13  100nF  [0402_C]
D1  0805 Red  [0805_LED_S1]
D2  0805 Green  [0805_LED_S1]
R6  4.7KΩ ±1%  [0805_R]
R7  4.7KΩ ±1%  [0805_R]
R8  0Ω ±1%  [0402_R]
R9  200Ω ±1%  [0402_R]
R10  100Ω ±1%  [0402_R]
R11  200Ω ±1%  [0402_R]
R12  10KΩ ±1%  [0402_R]
R13  10KΩ ±1%  [0402_R]
R14  100KΩ ±1%  [0402_R]
R15  100KΩ ±1%  [0402_R]
SW1  FSMSM  [TECO-FSMSM-2_V]
U2  STM32F103CBT6  [LQFP-48_7x7x05P]  (parts A,B of 2)
Y2  8MHz ±20ppm 20pF  [SMD-5032_2P]

### Ports
ST_JTCK (bidir), ST_JTMS (bidir), T_JTCK (bidir), T_JTMS (bidir), UART_RX (bidir), UART_TX (bidir), USB_D_N (bidir), USB_D_P (bidir)

### Nets
GND: C6.1 C7.1 C8.1 C9.1 C10.1 C11.2 C12.2 C13.1 D1.K R7.1 R8.1 R12.1 R13.1 R15.1 SW1.2 U2.8(VSSA) U2.23(VSS_1) U2.35(VSS_2) U2.47(VSS_3)
VCC3V3: R14.2 U2.1(VBAT) U2.9(VDDA) U2.24(VDD_1) U2.36(VDD_2) U2.48(VDD_3)
VCC3V3DEBUG: C6.2 C7.2 C8.2 C9.2 C10.2 D2.A R6.2
BOOT0: R15.2 U2.44(BOOT0)
BOOT1: R8.2 U2.20(PB2)
OSC_IN: C11.1 U2.5(PD0-OSC_IN) Y2.2(OSC2)
OSC_OUT: C12.1 U2.6(PD1) Y2.1(OSC1)
RST: C13.2 R14.1 SW1.1 U2.7(NRST)
ST_JTCK: U2.37(PA14) ; port ST_JTCK
ST_JTMS: U2.34(PA13) ; port ST_JTMS
STLINK_LED: R9.1 R11.1 U2.30(PA9)
T_JTCK: U2.26(PB13) ; port T_JTCK
T_JTMS: R10.2 U2.27(PB14) ; port T_JTMS
T_SWDIO_IN: R10.1 U2.25(PB12)
UART_RX: U2.13(PA3) ; port UART_RX
UART_TX: U2.12(PA2) ; port UART_TX
USB_D_N: U2.32(PA11) ; port USB_D_N
USB_D_P: U2.33(PA12) ; port USB_D_P
NetD1_A: D1.A R9.2
NetD2_K: D2.K R11.2
NetR6_1: R6.1 R7.2 U2.10(PA0-WKUP)
NetR12_2: R12.2 U2.2(PC13-TAMPER-RTC)
NetR13_2: R13.2 U2.3(PC14-OSC32_IN)

Not connected (* = marked no-connect by the designer): U2 4(PC15-OSC32_OUT) 11(PA1) 14(PA4) 15(PA5) 16(PA6) 17(PA7) 18(PB0) 19(PB1) 21(PB10) 22(PB11) 28(PB15) 29(PA8) 31(PA10) 38(PA15) 39(PB3) 40(PB4) 41(PB5) 42(PB6) 43(PB7) 45(PB8) 46(PB9)

### Layout directives
differential pair: USB_D_N, USB_D_P

### Library data of the parts
C6-C10 C13 = 0402 100nF (104) 10% 16V: Chip capacitors; Manufacturer: Samsung Electro-Mechanics; PartNumber: CL05B104KO5NNNC; Tolerance: 10%; Voltage: 16V; ComponentLink1Description: Supplier link; ComponentLink1URL: http://www.szlcsc.com/product/details_1877.html; Package: 0402; Supplier: LC; SuppliersPartNumber: C1525; Capacitance: 100nF
C11 C12 = 0402 30pF (300) 5% 50V: Chip capacitors; Manufacturer: Guangdong Fenghua Advanced Tech; PartNumber: 0402CG300J500NT; Tolerance: 5%; Voltage: 50V; ComponentLink1Description: Supplier link; ComponentLink1URL: http://www.szlcsc.com/product/details_1922.html; Package: 0402; Supplier: LC; SuppliersPartNumber: C1570; Capacitance: 30pF
D1 = 0805 LED Red: LED; ComponentLink1Description: 供应商链接; ComponentLink1URL: http://www.szlcsc.com/product/details_2668.html; Package: 0805; Supplier: LC; SuppliersPartNumber: C2295; Color: Red
D2 = 0805 LED Green: LED; ComponentLink1Description: 供应商链接; ComponentLink1URL: http://www.szlcsc.com/product/details_2670.html; Package: 0805; Supplier: LC; SuppliersPartNumber: C2297; Color: Green
R6 R7 = 0805 4.7K (4701) 1%: Chip resistor; Manufacturer: Uniroyal Elec; Power: 1/8W; ComponentLink1Description: Supplier link; ComponentLink1URL: http://www.szlcsc.com/product/details_18361.html; Package: 0805; Supplier: LC; SuppliersPartNumber: C17673; Tolerance: 1%
R8 = 0402 0R (0R0) 1%: Chip resistor; Manufacturer: Uniroyal Elec; PartNumber: 0402WGF0000TCE; Power: 1/16W; ComponentLink1Description: Supplier link; ComponentLink1URL: http://www.szlcsc.com/product/details_17853.html; Package: 0402; Supplier: LC; SuppliersPartNumber: C17168; Resistance: 0Ω; Tolerance: 1%
R9 R11 = 0402 200R (2000) 1%: Chip resistor; Manufacturer: Uniroyal Elec; PartNumber: 0402WGF2000TCE; Power: 1/16W; ComponentLink1Description: Supplier link; ComponentLink1URL: http://www.szlcsc.com/product/details_25830.html; Package: 0402; Supplier: LC; SuppliersPartNumber: C25087; Resistance: 200Ω; Tolerance: 1%
R10 = 0402 100R (1000) 1%: Chip resistor; Manufacturer: Uniroyal Elec; PartNumber: 0402WGF1000TCE; Power: 1/16W; ComponentLink1Description: Supplier link; ComponentLink1URL: http://www.szlcsc.com/product/details_25819.html; Package: 0402; Supplier: LC; SuppliersPartNumber: C25076; Resistance: 100Ω; Tolerance: 1%
R12 R13 = 0402 10K (1002) 1%: Chip resistor; Manufacturer: Uniroyal Elec; PartNumber: 0402WGF1002TCE; Power: 1/16W; ComponentLink1Description: Supplier link; ComponentLink1URL: http://www.szlcsc.com/product/details_26487.html; Package: 0402; Supplier: LC; SuppliersPartNumber: C25744; Resistance: 10KΩ; Tolerance: 1%
R14 R15 = 0402 100K (1003) 1%: Chip resistor; Manufacturer: Uniroyal Elec; PartNumber: 0402WGF1003TCE; Power: 1/16W; ComponentLink1Description: Supplier link; ComponentLink1URL: http://www.szlcsc.com/product/details_26484.html; Package: 0402; Supplier: LC; SuppliersPartNumber: C25741; Resistance: 100KΩ; Tolerance: 1%
SW1 = CMP-2000-07511-1: FSMSM Push Button Switch, 50 mA, -35 to 85 degC, 2-Pin SMD, RoHS, Bulk; Manufacturer: TE Connectivity; Actuator Length: 1.07mm; Electrical Life: 20000Cycles; Actuator Material: Polyamide; Current Rating: 50mA; Illumination Type: Illuminated; Voltage Rating (DC): 24V; Contact Resistance: 100mOhm; Case\/Package: SMD/SMT; Operating Force: 180gf; Switch Travel: 0.25mm; Max Voltage Rating (DC): 12V; Throw Configuration: SPST; Packaging: LoosePiece; Max Operating Temperature: 85degC; ELV: Compliant; Package Description: 2-Pin Surface Mount Device, Body 6 x 3.5 mm, Pitch 9.19 mm; RoHSCompliant: true; Manufacturer URL: http://www.te.com/; Contact Plating: Silver; Contact Material: Brass; Mounting Technology: SurfaceMount; Contact Current Rating: 50mA; Datasheet Version: Rev. C2, 08/2014; Datasheet URL: http://www.te.com/commerce/DocumentDelivery/DDEController?Action=showdoc&DocId=Customer+Drawing%7F1437566-3%7FC2%7Fpdf%7FEnglish%7FENG_CD_1437566-3_C2_1437566_3_1_c.dwg.pdf%7F1437566-3; Mechanical Life: 20000Cycles; Package Reference: FSMSM; REACH SVHC: Unknown; Orientation: Straight; Min Operating Temperature: -35degC; Lead Free: LeadFree; Termination: GullWing; Package Quantity: 1000; Mount: SurfaceMount
U2 = STM32F103CBT6: ARM; ComponentLink1Description: 供应商链接; ComponentLink1URL: http://www.szlcsc.com/product/details_8796.html; Package: LQFP-48_7x7x05P; Supplier: LC; SuppliersPartNumber: C8304
Y2 = SMD-5032_2P 8MHz 20ppm 20pF: 贴片晶振; ComponentLink1Description: 供应商链接; ComponentLink1URL: http://www.szlcsc.com/product/details_117214.html; Package: SMD-5032_2P; Supplier: LC; SuppliersPartNumber: C115962

## Sheet Power.SchDoc
size A4
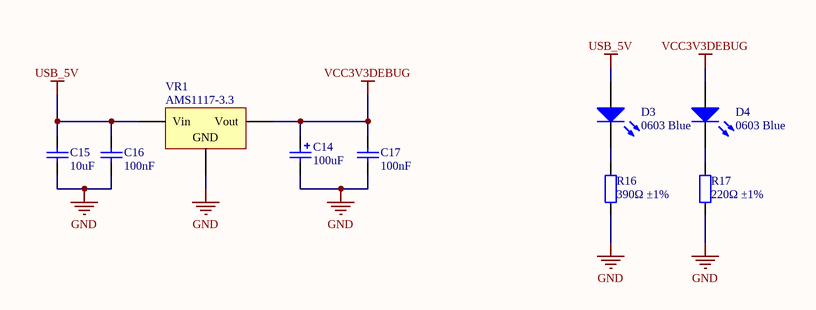
[diagram p6: Power.SchDoc]

### Parts
C14  100uF  [CASE-B_3528]
C15  10uF  [1206_C]
C16  100nF  [0402_C]
C17  100nF  [1206_C]
D3  0603 Blue  [0603_LED_S1]
D4  0603 Blue  [0603_LED_S1]
R16  390Ω ±1%  [0603_R]
R17  220Ω ±1%  [0402_R]
VR1  AMS1117-3.3  [SOT-223]

### Nets
GND: C14.2 C15.1 C16.1 C17.1 R16.1 R17.1 VR1.1(GND)
USB_5V: C15.2 C16.2 D3.A VR1.3(Vin)
VCC3V3DEBUG: C14.1 C17.2 D4.A VR1.2(Vout)
NetD3_K: D3.K R16.2
NetD4_K: D4.K R17.2

### Library data of the parts
C14 = 3528 100uF (107) 10% 6.3V: Tantalum capacitor; Manufacturer: AVX; PartNumber: TAJB107K006RNJ; Tolerance: 10%; Voltage: 6.3V; ComponentLink1Description: Supplier link; ComponentLink1URL: http://www.szlcsc.com/product/details_16815.html; Package: 3528; Supplier: LC; SuppliersPartNumber: C16133; Capacitance: 100uF
C15 = 1206 10uF (106) 10% 50V: Chip capacitors; Manufacturer: Samsung Electro-Mechanics; PartNumber: CL31A106KBHNNNE; Tolerance: 10%; Voltage: 50V; ComponentLink1Description: Supplier link; ComponentLink1URL: http://www.szlcsc.com/product/details_14236.html; Package: 1206; Supplier: LC; SuppliersPartNumber: C13585; Capacitance: 10uF
C16 = 0402 100nF (104) 10% 16V: as C6 on sheet DebuggerMCU; ComponentLink1Description: Supplier link; ComponentLink1URL: http://www.szlcsc.com/product/details_1877.html; Package: 0402; Supplier: LC; SuppliersPartNumber: C1525; Capacitance: 100nF
C17 = 1206 100nF (104) 10% 50V: Chip capacitors; Manufacturer: Samsung Electro-Mechanics; PartNumber: CL31B104KBCNNNC; Tolerance: 10%; Voltage: 50V; ComponentLink1Description: Supplier link; ComponentLink1URL: http://www.szlcsc.com/product/details_25237.html; Package: 1206; Supplier: LC; SuppliersPartNumber: C24497; Capacitance: 100nF
D3 D4 = 0603 LED Blue: LED; ComponentLink1Description: 供应商链接; ComponentLink1URL: http://www.szlcsc.com/product/details_73150.html; Package: 0603; Supplier: LC; SuppliersPartNumber: C72041; Color: Blue
R16 = 0603 390R (3900) 1%: Chip resistor; Manufacturer: Uniroyal Elec; PartNumber: 0603WAF3900T5E; Power: 1/10W; ComponentLink1Description: Supplier link; ComponentLink1URL: http://www.szlcsc.com/product/details_23878.html; Package: 0603; Supplier: LC; SuppliersPartNumber: C23151; Resistance: 390Ω; Tolerance: 1%
R17 = 0402 220R (2200) 1%: Chip resistor; Manufacturer: Uniroyal Elec; PartNumber: 0402WGF2200TCE; Power: 1/16W; ComponentLink1Description: Supplier link; ComponentLink1URL: http://www.szlcsc.com/product/details_25834.html; Package: 0402; Supplier: LC; SuppliersPartNumber: C25091; Resistance: 220Ω; Tolerance: 1%
VR1 = SOT-223 AMS1117-3.3: 低压差线性稳压(LDO); ComponentLink1Description: 供应商链接; ComponentLink1URL: http://www.szlcsc.com/product/details_6652.html; Package: SOT-223; Supplier: LC; SuppliersPartNumber: C6186